# EAGLE design base3-5pin-interface-SDA-SCL-Switch-on-output-posunute-konektory-posunuty-vstup (EAGLE 7.2.0)
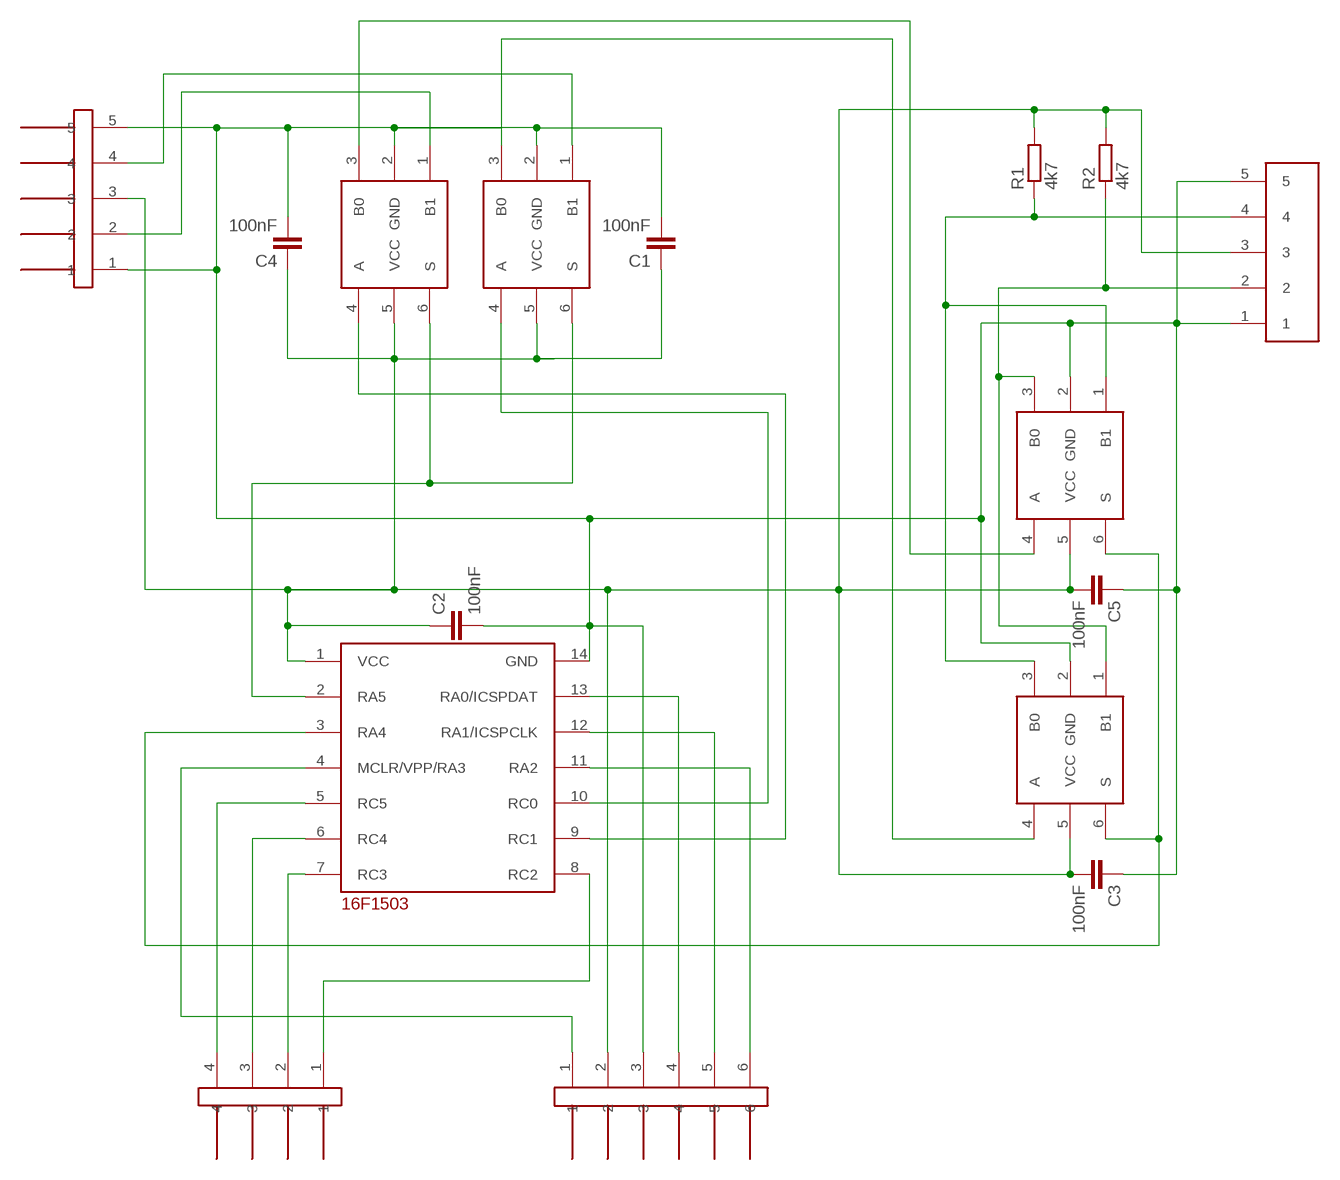
[diagram p0: schematic, sheet 1]

## Parts
C1  100nF  C-EUC0603  [C0603]
C2  100nF  C-EUC0603  [C0603]
C3  100nF  C-EUC0603  [C0603]
C4  100nF  C-EUC0603  [C0603]
C5  100nF  C-EUC0603  [C0603]
R1  4k7  R-EU_M0805  [M0805]
R2  4k7  R-EU_M0805  [M0805]
U$1  16F103-TSSOP  [TSSOP14]
U$2  NC7SB3157P6X  [SC70-6L]
U$3  NC7SB3157P6X  [SC70-6L]
U$4  JUMPER5M-90  [JUMPER5M-90]
U$5  JUMPER5F-90  [JUMPER5F-90]
U$6  NC7SB3157P6X  [SC70-6L]
U$7  NC7SB3157P6X  [SC70-6L]
U$8  JUMPER6M  [JUMPER6M]
U$9  JUMPER4M  [JUMPER4M]

## Nets
GND: C1.2 C2.2 C3.1 C4.2 C5.1 U$1.14(GND) U$2.2(GND) U$3.2(GND) U$4.1 U$4.5 U$5.1 U$5.5 U$6.2(GND) U$7.2(GND) U$8.3
N$1: U$1.3(RA4) U$6.6(S) U$7.6(S)
N$2: U$1.10(RC0) U$2.4(A)
N$3: U$1.7(RC3) U$9.2
N$4: U$1.9(RC1) U$3.4(A)
N$5: U$2.1(B1) U$4.4
N$6: R1.1 U$5.4 U$6.1(B1) U$7.3(B0)
N$7: U$3.3(B0) U$6.4(A)
N$8: U$3.1(B1) U$4.2
N$9: U$1.2(RA5) U$2.6(S) U$3.6(S)
N$10: R2.1 U$5.2 U$6.3(B0) U$7.1(B1)
N$11: U$1.11(RA2) U$8.6
N$12: U$1.5(RC5) U$9.4
N$13: U$1.4(MCLR/VPP/RA3) U$8.1
N$14: U$1.13(RA0/ICSPDAT) U$8.4
N$15: U$1.12(RA1/ICSPCLK) U$8.5
N$17: U$1.6(RC4) U$9.3
N$18: U$1.8(RC2) U$9.1
N$20: U$2.3(B0) U$7.4(A)
VCC: C1.1 C2.1 C3.2 C4.1 C5.2 R1.2 R2.2 U$1.1(VCC) U$2.5(VCC) U$3.5(VCC) U$4.3 U$5.3 U$6.5(VCC) U$7.5(VCC) U$8.2

## Library data of the parts
C1-C5 = resistor:C-EU: CAPACITOR, European symbol
R1 R2 = resistor:R-EU_: RESISTOR, European symbol
U$1 = !stavebnice03:16F103-TSSOP
U$2 U$3 U$6 U$7 = !stavebnice03:NC7SB3157P6X
U$4 = !stavebnice03:JUMPER5M-90
U$5 = !stavebnice03:JUMPER5F-90
U$8 = !stavebnice03:JUMPER6M
U$9 = !stavebnice03:JUMPER4M

## Board
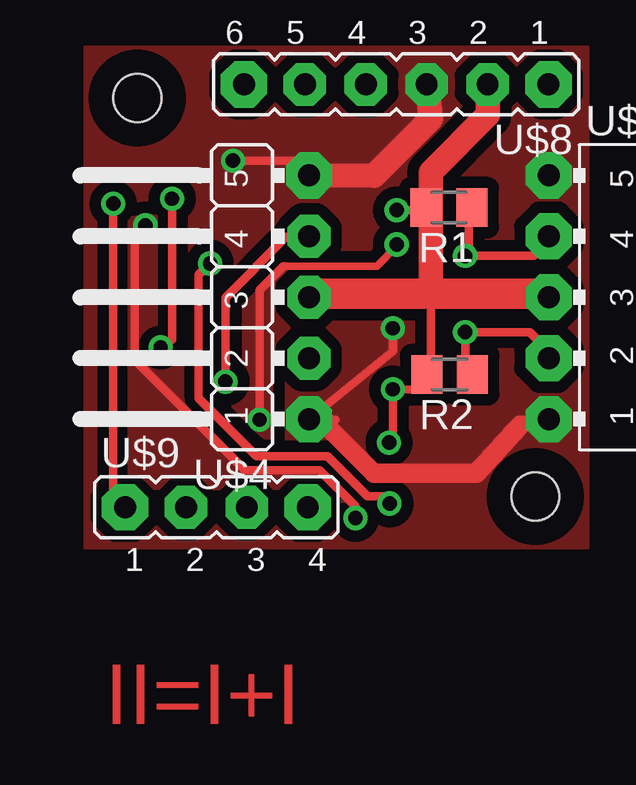
[diagram p1: board, top side]
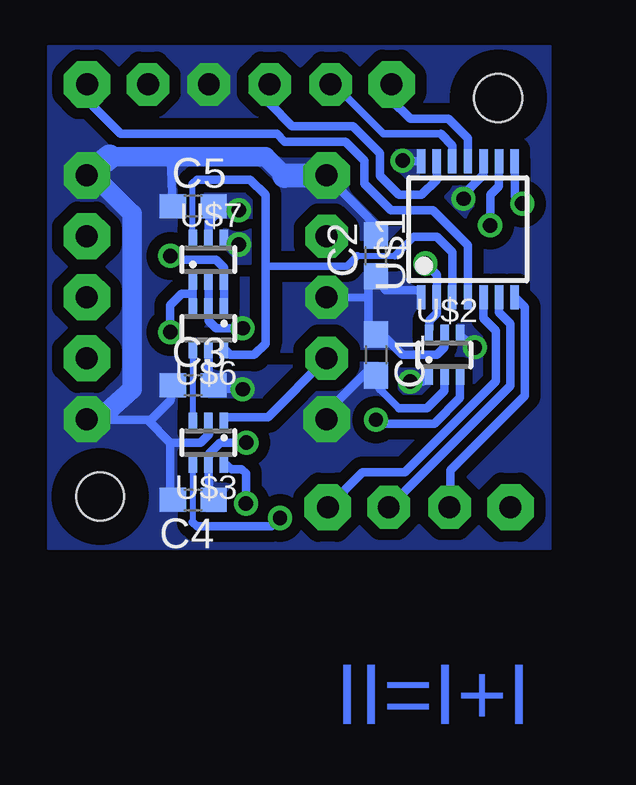
[diagram p2: board, bottom side, seen from below]

No outline drawn. Coordinates in mm, seen from the top.
Copper layers (1*16): Top 0.035mm / dielectric 1.5mm / Bottom 0.035mm
Design rules "default": minimum track width 10mil, minimum drill 24mil, track to track 8mil, track to pad 8mil, pad to pad 8mil, via to via 8mil, smd to smd 8mil, copper to edge 40mil, drill to drill 8mil, minimum pad ring 10mil, minimum via ring 8mil, stop-mask expansion 4mil, vias tented up to drill 0mil, thermal gap 10mil
Holes 2 mm at 2.2,18.8 18.8,2.2

### Footprints (pad centres in the part's own frame; a part is rotated, then mirrored left to right if it is on the bottom)
C0603 = smd 1.1 x 1: 1 -0.85,0; 2 0.85,0
M0805 = smd 1.3 x 1.6: 1 -0.95,0; 2 0.95,0
TSSOP14 = smd 0.35 x 1: 1 -1.95,-2.825; 2 -1.3,-2.825; 3 -0.65,-2.825; 4 0,-2.825; 5 0.65,-2.825; 6 1.3,-2.825; 7 1.95,-2.825; 8 1.95,2.825; 9 1.3,2.825; 10 0.65,2.825; 11 0,2.825; 12 -0.65,2.825; 13 -1.3,2.825; 14 -1.95,2.825
SC70-6L = smd 0.35 x 0.8: 1 -0.65,-0.85; 2 0,-0.85; 3 0.65,-0.85; 4 0.65,0.85; 5 0,0.85; 6 -0.65,0.85
JUMPER5M-90 = drill 0.914 pad 1.93 octagon: 1 -5.08,-2.54; 5 5.08,-2.54 | drill 0.914 pad 1.778 octagon: 2 -2.54,-2.54; 3 0,-2.54; 4 2.54,-2.54
JUMPER5F-90 = drill 0.914 pad 1.93 octagon: 1 5.08,-2.54; 2 2.54,-2.54; 3 0,-2.54; 4 -2.54,-2.54; 5 -5.08,-2.54
JUMPER6M = drill 0.914 pad 1.93 octagon: 1 -6.35,0; 6 6.35,0 | drill 0.914 pad 1.778 octagon: 2 -3.81,0; 3 -1.27,0; 4 1.27,0; 5 3.81,0
JUMPER4M = drill 0.914 pad 1.93 octagon: 1 -3.81,0; 4 3.81,0 | drill 0.914 pad 1.778 octagon: 2 -1.27,0; 3 1.27,0

### Placement (x,y rotation side)
C1  7.3,8.1 270 bottom
C2  7.3,12.22 90 bottom
C3  14.92,6.83 0 bottom
C4  14.92,2.06 180 bottom
C5  14.92,14.29 0 bottom
R1  15.2,14.24 180 top
R2  15.23,7.28 180 top
U$1  3.47,13.34 0 bottom
U$2  4.45,8.1 0 bottom
U$3  14.29,4.45 180 bottom
U$4  6.82,10.5 90 top
U$5  21.9,10.5 270 top
U$6  14.29,9.21 180 bottom
U$7  14.29,12.06 0 bottom
U$8  13,19.37 180 top
U$9  5.5,1.75 0 top

### Tracks (layer width: path | path; a pad name or v marks a point on that pad's centre or on a via)
GND  (via drill 0.6)
  Top 0.356: 10.95,15.56 U$4.5 9.21,16.19 v6.19,16.19 | 10.48,5.4 U$4.1 | U$4.1 9.92,5.32 | 18.1,5.08 18.1,5.4 U$5.1 | v12.86,9.21 12.86,8.26 U$4.1
  Top 0.8: 12.06,3.17 9.92,5.32
  Top 0.813: 12.06,3.17 16.35,3.17 18.1,5.08
  Top 1.016: U$8.3 14.45,17.94 12.06,15.56 U$4.5
  Bottom 0.305: 6.35,5.87 7.14,6.67
  Bottom 0.356: C5.1 15.87,16.35 15.08,16.35 | U$7.2 U$6.2 14.29,9.53 13.97,9.21 v12.86,9.21 | C3.1 15.86,6.21 16.67,5.4 16.83,5.4 | 16.83,5.4 18.89,5.4 | U$1.14 6.07,16.16 v6.19,16.19 | U$3.2 14.27,4.78 14.61,4.45 15.88,4.45 | 15.88,4.45 16.83,5.4 | U$2.2 4.45,6.61 5.18,5.87 6.35,5.87 | 7.14,6.67 C1.2 7.68,7.41 9.21,5.87 U$4.1 | 15.88,4.45 15.88,2.17 C4.2 | C2.2 7.04,13.23 U$4.5 | 19.05,15.56 19.05,15.4 U$5.5
  Bottom 0.813: 11.11,15.56 11.91,16.35 15.08,16.35 18.41,16.35 | 18.89,5.4 17.46,6.67 17.46,13.97 19.05,15.56
  Bottom 1.016: U$4.5 11.11,15.56 | 18.41,16.35 U$5.5 | 18.89,5.4 U$5.1
  pour Top (isolate 0.483, rank 2, no thermals): 0,0.03 0,20.95 21,20.95 21,0.03
  pour Bottom (isolate 0.483, rank 2, no thermals): 0,0.03 0,20.95 20.99,20.95 20.99,0.03
N$1
  Bottom 0.254: 8.08,12.22 6.51,12.22 | U$7.6 14.94,15.22
  Bottom 0.305: 6.51,12.22 5.71,13.02 | 8.1,12.22 8.08,12.22 8.5,11.8 11.91,11.8
  Bottom 0.356: U$1.3 4.12,12.37 4.76,13.02 5.71,13.02 | U$6.6 13.38,8.1 12.38,8.1 11.91,8.57 11.91,11.8 11.91,14.76 12.54,15.4 14.76,15.4 14.94,15.22
N$2  (via drill 0.6)
  Top 0.356: v3.17,8.41 3.65,8.73 v3.65,14.61
  Bottom 0.356: U$1.10 2.82,15.6 3.65,14.76 v3.65,14.61 | U$2.4 3.71,8.79
  Bottom 0.406: 3.71,8.79 v3.17,8.41
  pour Bottom (isolate 0.508, no thermals): 3.02,15.4 3.02,12.7 4.92,14.61 4.13,15.4
  pour Bottom (isolate 0.356, no thermals): 2.7,6.64 3.97,6.64 3.97,9.37 2.7,9.37
N$3
  Bottom 0.357: U$1.7 1.1,10.09 1.1,6.4 4.2,3.3 4.2,1.78 U$9.2
N$4  (via drill 0.6)
  Top 0.357: v11.3,1.3 11.3,1.8 9.8,3.3 6.7,3.3 2.1,7.9 2.1,13.05 v2.54,13.49
  Bottom 0.254: U$3.4 14.94,1.13
  Bottom 0.356: U$1.9 2.17,15.13 2.54,14.76 v2.54,13.49 | 12.09,0.95 14.76,0.95 14.94,1.13
  Bottom 0.357: 12.09,0.95 11.65,0.95 v11.3,1.3
  pour Top (isolate 0.406, no thermals): 1.8,13.7 3,13.8 4.7,5.3 6.8,3.3 9.8,3.3 11,2.1 1.9,2
N$5  (via drill 0.6)
  Top 0.356: v5.87,6.99 5.87,10.48 8.41,13.02 U$4.4
  Bottom 0.356: v5.87,6.99 5.36,6.99 U$2.1
  pour Bottom (isolate 0.356, no thermals): 5.08,7.78 6.35,7.78 6.35,6.67 6.19,6.51 5.08,6.51
N$6  (via drill 0.6)
  Top 0.356: R1.1 16.03,14.22 16.03,12.38 v15.88,12.22 18.73,12.22 19.37,12.86 U$5.4
  Bottom 0.356: U$6.1 U$7.3 13.64,11.73 13.97,12.06 15.72,12.06 v15.88,12.22
N$7
  Bottom 0.254: U$6.4 U$3.3
N$8
  Bottom 0.356: U$3.1 13.64,5.46 13.6,5.5 11.8,5.5 U$4.2
N$9  (via drill 0.6)
  Top 0.356: 9.93,3.87 7.18,3.87 4.76,6.29 4.76,11.43 v5.24,11.91
  Top 0.357: 9.93,3.87 10.13,3.87 11.8,2.2 12.43,2.2 v12.72,1.91
  Bottom 0.356: v5.24,11.91 4.77,11.44 U$1.2 4.77,9.84 5.08,9.53 5.08,9.28 U$2.6 | v12.72,1.91 12.72,3.16 12.9,3.33 13.32,3.33 U$3.6
N$10  (via drill 0.6)
  Top 0.356: R2.1 15.88,7.23 v15.88,9.05 18.57,9.05 19.37,8.26 U$5.2
  Bottom 0.356: U$6.3 14.94,10.64 | 14.94,10.64 U$7.1 | v15.88,9.05 15.88,10.16 15.4,10.64 14.94,10.64
N$11
  Bottom 0.356: U$1.11 3.47,17.12 4.29,17.94 5.87,17.94 6.67,18.73 U$8.6
N$12
  Bottom 0.357: U$1.5 2.82,9.62 2.3,9.1 2.3,7 6.1,3.2 7.86,3.2 U$9.4
N$13
  Bottom 0.356: U$1.4 3.47,12.68 4.92,14.13 6.67,14.13 7.78,15.24 7.78,16.19 8.57,16.99 11.11,16.99 11.43,17.3 17.94,17.3 19.37,18.73 U$8.1
N$14
  Bottom 0.356: U$1.13 4.77,15.39 5.4,14.76 6.35,14.76 7.14,15.56 7.14,16.51 8.26,17.62 10.79,17.62 11.75,18.57 U$8.4
N$15
  Bottom 0.305: 4.6,17.3 6.99,17.3 8.57,18.89
  Bottom 0.356: U$1.12 4.12,16.82 4.6,17.3 | 8.57,18.89 9.05,18.89 U$8.5
N$17
  Bottom 0.357: U$1.6 2.17,9.87 1.7,9.4 1.7,6.82 U$9.3
N$18  (via drill 0.6)
  Top 0.357: v1.2,14.4 1.2,2.24 U$9.1
  Bottom 0.357: U$1.8 1.52,14.72 v1.2,14.4
N$20  (via drill 0.6)
  Top 0.305: 13.02,12.62 12.2,11.8 8.31,11.8
  Top 0.356: v13.02,12.7 13.02,12.62 | 8.31,11.8 7.3,10.79 v7.3,5.4
  Bottom 0.356: v13.02,12.7 13.42,12.7 U$7.4 | U$2.3 3.79,6.31 4.86,5.24 7.14,5.24 v7.3,5.4
  pour Top (isolate 0.508): 8.73,12.38 8.73,9.21 7.78,8.1 7.8,8.08 7.8,4.45 6.67,5.24 6.03,5.71 6.19,9.84
  pour Bottom (isolate 0.381, no thermals): 13.65,13.34 12.54,13.34 12.54,11.91 13.18,11.91 13.65,12.38
VCC  (via drill 0.6)
  Top 0.356: v13.02,14.13 14.45,14.13 14.45,13.81 | 17.2,10.43 17.46,10.64 | 14.45,10.64 14.61,10.64 | R1.2 14.35,14.06 14.45,13.97 | 14.13,10.64 14.38,10.41 14.45,10.34 14.45,7.35 R2.2 14.28,7.13 14.29,6.67 13.2,6.64 v12.86,6.67 12.86,4.6 v12.7,4.45
  Top 0.813: 9.37,10.48 9.53,10.64 | 14.13,10.64 14.61,10.64 | 19.21,10.64 18.89,10.48 U$5.3
  Top 1.016: 14.45,10.64 14.45,13.81 14.45,13.97 14.45,14.13 14.45,15.72 16.83,18.1 U$8.2
  Top 1.27: U$4.3 9.37,10.48 | 9.53,10.64 14.13,10.64 | 14.61,10.64 17.46,10.64 19.21,10.64
  Bottom 0.356: U$7.5 14.29,13.65 13.97,13.97 C5.2 13.81,14.13 v13.02,14.13 | 14.29,7.32 C3.2 | U$6.5 14.29,7.32 | 14.29,7.32 14.15,6.69 v12.86,6.67 | C4.1 14.27,2.1 U$3.5 14.27,3.99 13.81,4.45 v12.7,4.45 | U$4.3 7.62,10.48 | 7.62,10.48 7.62,10.92 C2.1 6.91,10.79 5.56,10.79 5.42,10.66 U$1.1 | 7.62,10.48 7.62,9.11 C1.1 7.41,8.89 6.99,8.89 6.19,8.1 4.76,8.1 4.45,8.41 U$2.5
  pour Bottom (isolate 0.508, no thermals): 5.56,11.75 11.43,11.75 11.59,11.59 11.59,8.26 5.56,8.26
  pour Bottom (isolate 0.508, no thermals): 14.45,8.41 14.61,6.35 12.06,6.35 10.79,7.62 13.18,7.62
  pour Bottom (isolate 0.406, no thermals): 14.45,3.17 14.45,1.43 12.54,1.43 12.54,3.17
  pour Bottom (isolate 0.356, no thermals): 14.61,13.97 14.61,15.08 12.54,15.08 12.38,14.92 12.38,13.81 14.61,13.81

### Text on the board
Top: II=I+I
Bottom: II=I+I
Dimension: 5 pins - v2